# EasyEDA schematic SCH_Krishveer's-HackBoard_2025-03-21.json

## Sheets
1 Switches: TITLE: Sheet_1; REV: 1.0; Date: 2025-02-24; Sheet: 1/1; Drawn By: krishveersinghkhurana; Company: Your Company
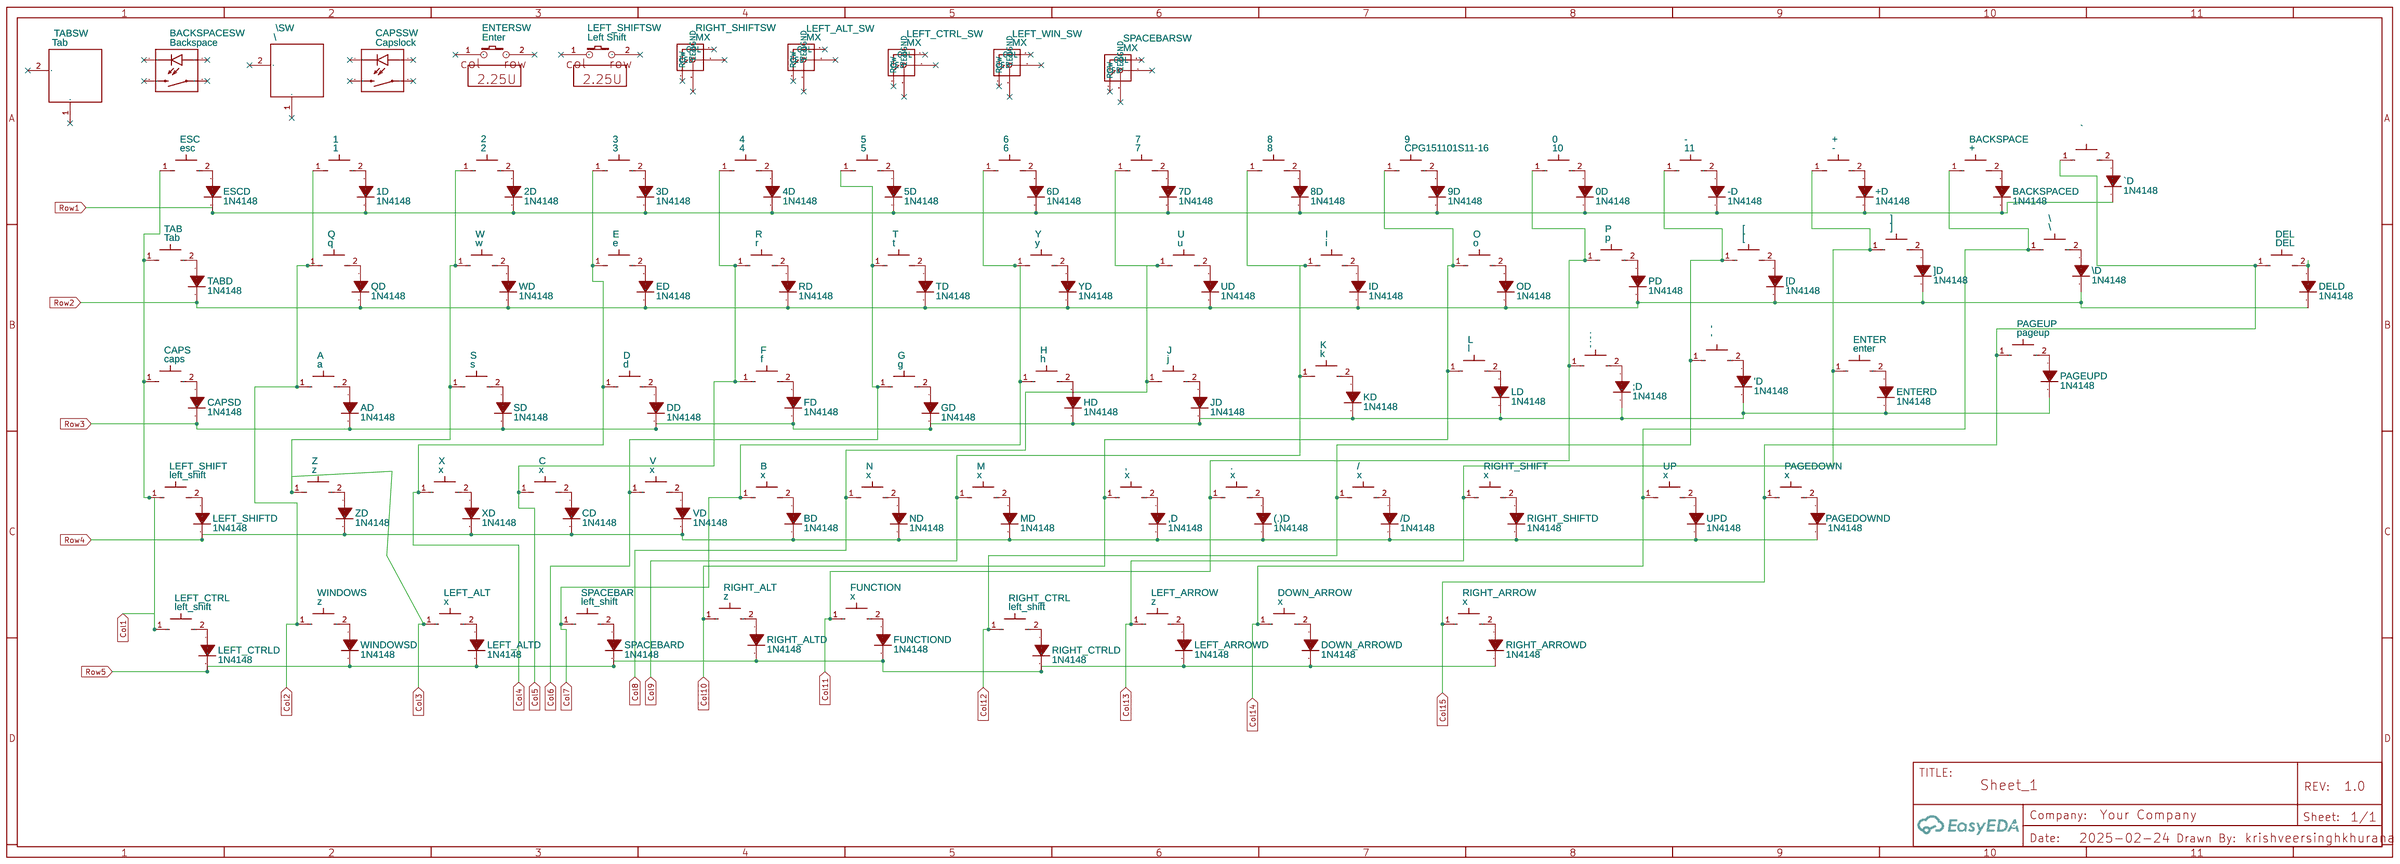
[diagram p0: Switches]
2 MCU: TITLE: Sheet_2
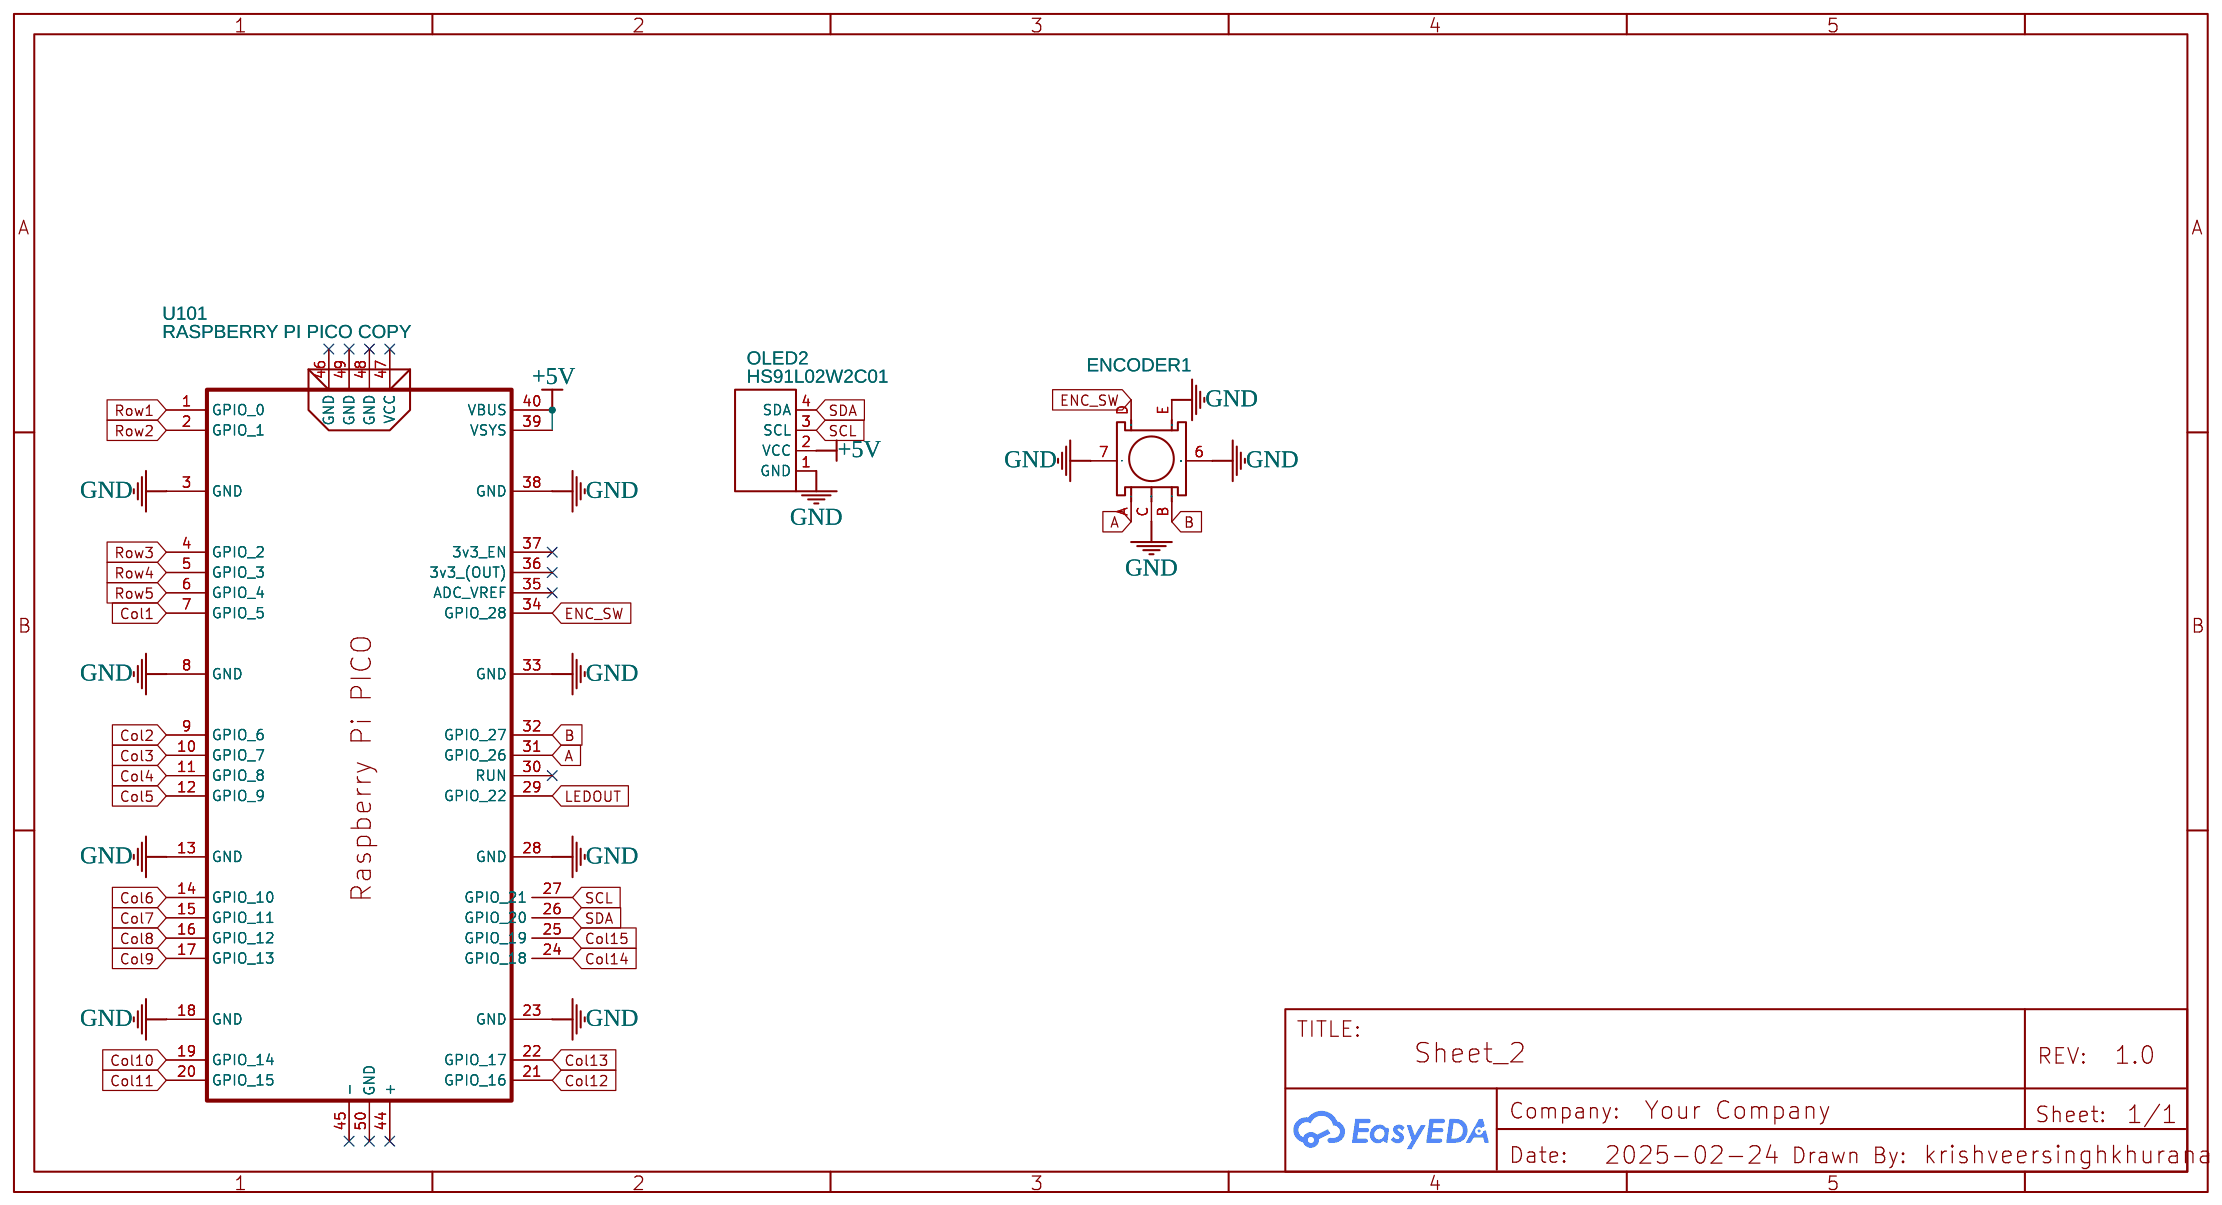
[diagram p1: MCU]
3 LED: Date: 2025-03-15
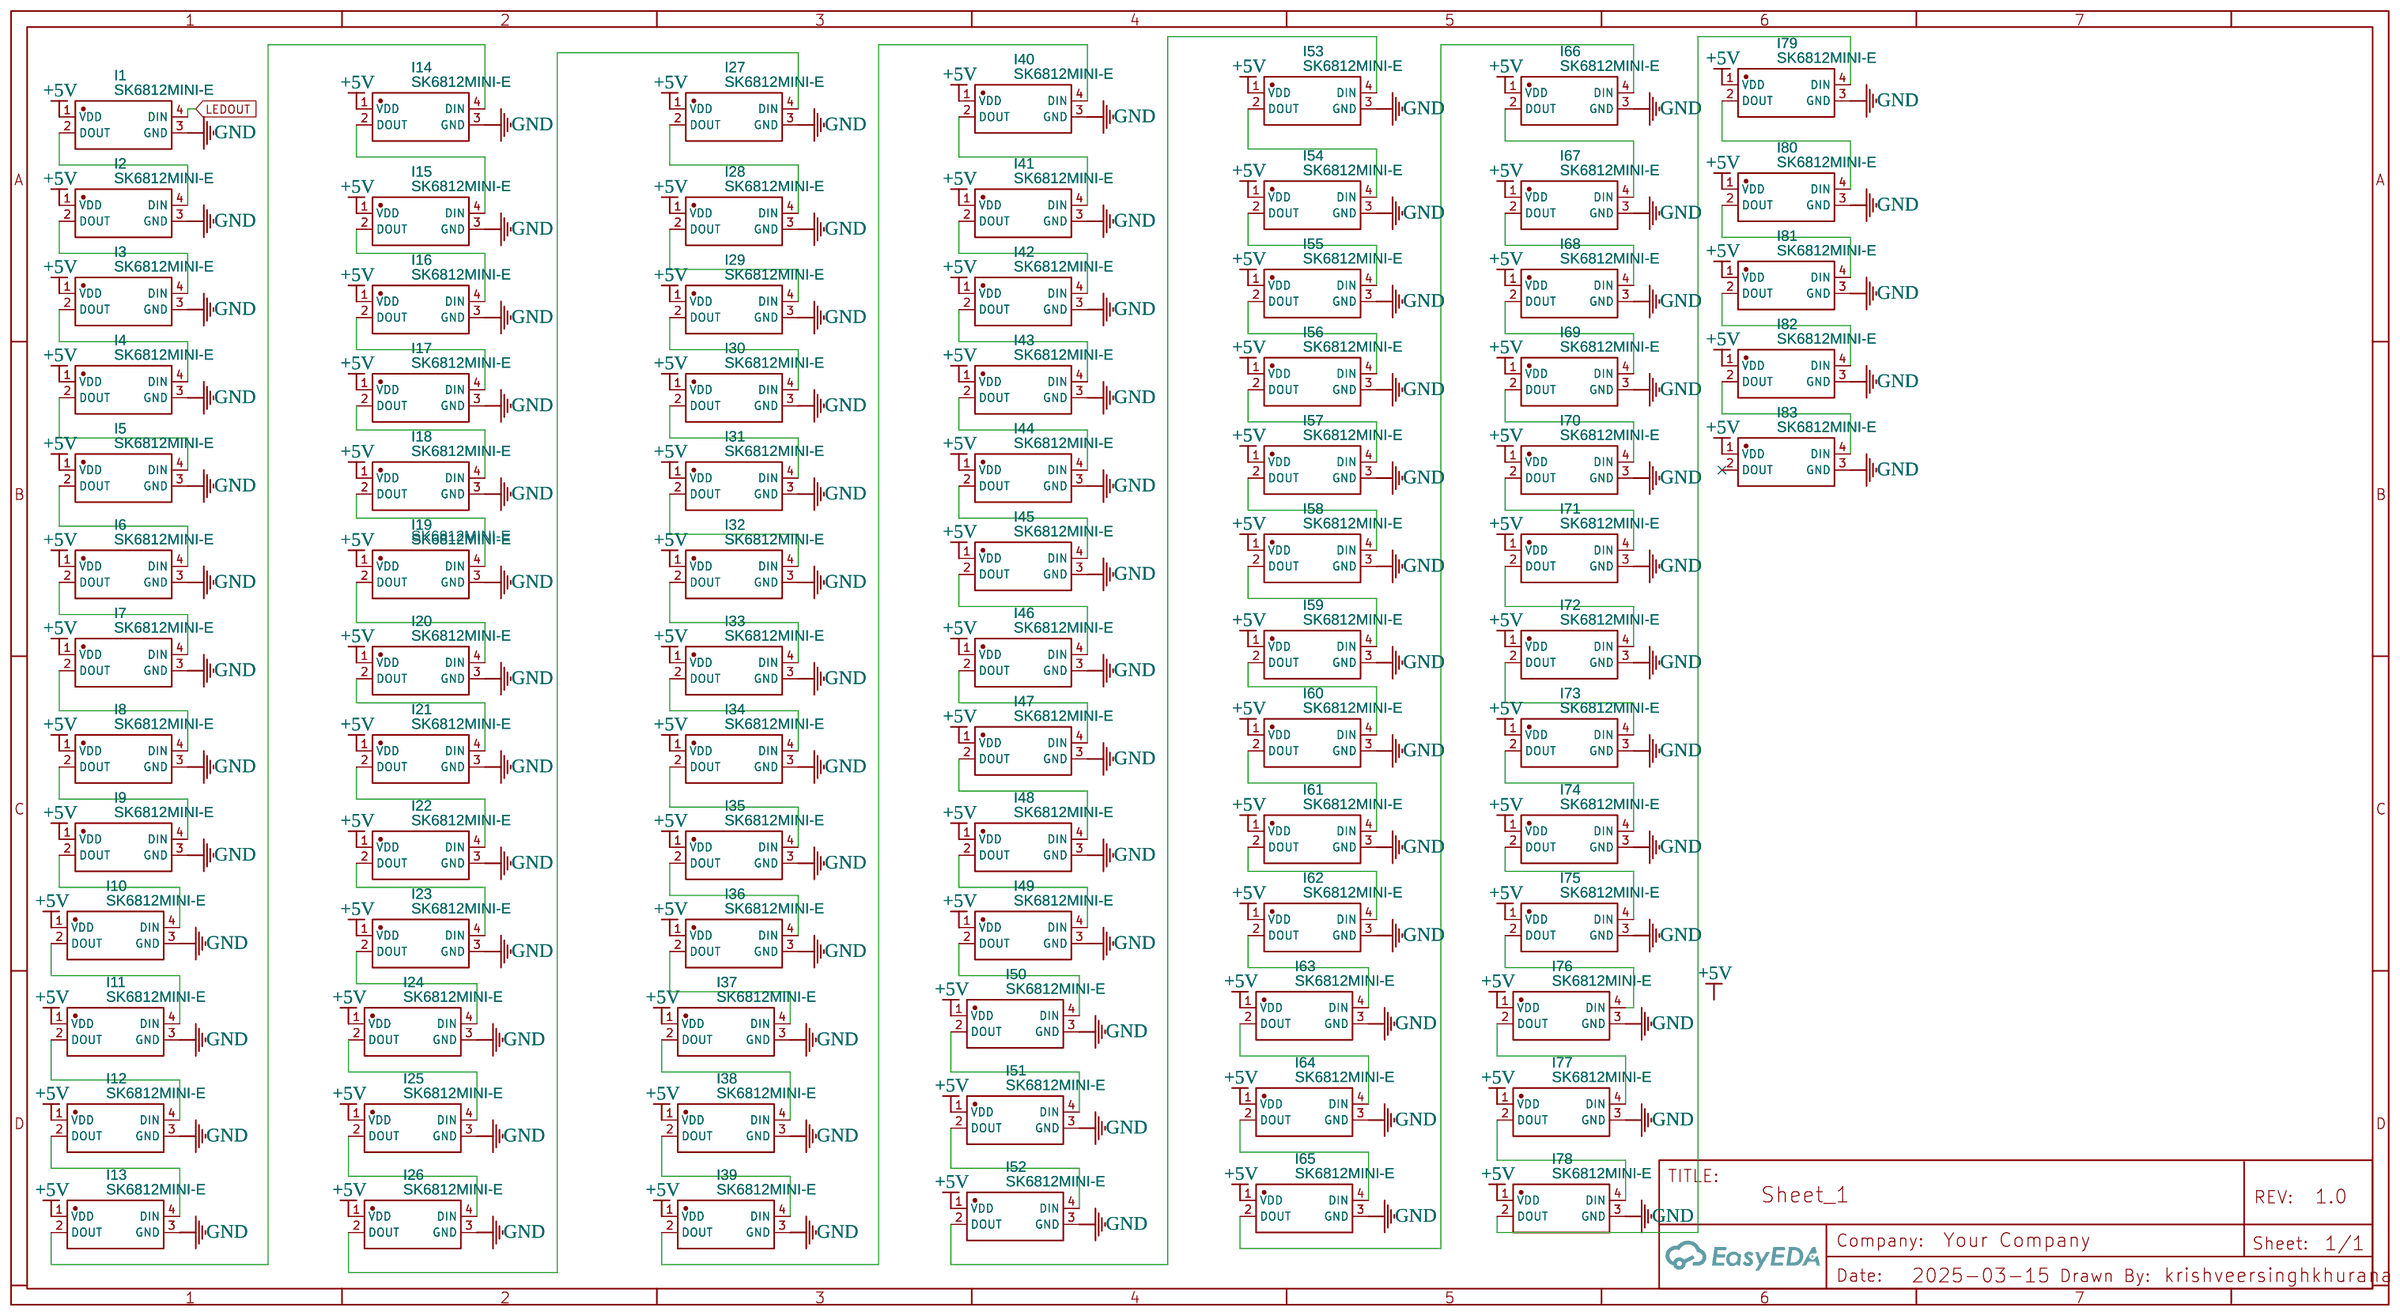
[diagram p2: LED]

## Parts
sheet LED
I1  SK6812MINI-E  [LED-SMD_L3.2-W2.8-P1.50-LS5.8-TR-EH]
I2  SK6812MINI-E  [LED-SMD_L3.2-W2.8-P1.50-LS5.8-TR-EH]
I3  SK6812MINI-E  [LED-SMD_L3.2-W2.8-P1.50-LS5.8-TR-EH]
I4  SK6812MINI-E  [LED-SMD_L3.2-W2.8-P1.50-LS5.8-TR-EH]
I5  SK6812MINI-E  [LED-SMD_L3.2-W2.8-P1.50-LS5.8-TR-EH]
I6  SK6812MINI-E  [LED-SMD_L3.2-W2.8-P1.50-LS5.8-TR-EH]
I7  SK6812MINI-E  [LED-SMD_L3.2-W2.8-P1.50-LS5.8-TR-EH]
I8  SK6812MINI-E  [LED-SMD_L3.2-W2.8-P1.50-LS5.8-TR-EH]
I9  SK6812MINI-E  [LED-SMD_L3.2-W2.8-P1.50-LS5.8-TR-EH]
I10  SK6812MINI-E  [LED-SMD_L3.2-W2.8-P1.50-LS5.8-TR-EH]
I11  SK6812MINI-E  [LED-SMD_L3.2-W2.8-P1.50-LS5.8-TR-EH]
I12  SK6812MINI-E  [LED-SMD_L3.2-W2.8-P1.50-LS5.8-TR-EH]
I13  SK6812MINI-E  [LED-SMD_L3.2-W2.8-P1.50-LS5.8-TR-EH]
I14  SK6812MINI-E  [LED-SMD_L3.2-W2.8-P1.50-LS5.8-TR-EH]
I15  SK6812MINI-E  [LED-SMD_L3.2-W2.8-P1.50-LS5.8-TR-EH]
I16  SK6812MINI-E  [LED-SMD_L3.2-W2.8-P1.50-LS5.8-TR-EH]
I17  SK6812MINI-E  [LED-SMD_L3.2-W2.8-P1.50-LS5.8-TR-EH]
I18  SK6812MINI-E  [LED-SMD_L3.2-W2.8-P1.50-LS5.8-TR-EH]
I19  SK6812MINI-E  [LED-SMD_L3.2-W2.8-P1.50-LS5.8-TR-EH]
I20  SK6812MINI-E  [LED-SMD_L3.2-W2.8-P1.50-LS5.8-TR-EH]
I21  SK6812MINI-E  [LED-SMD_L3.2-W2.8-P1.50-LS5.8-TR-EH]
I22  SK6812MINI-E  [LED-SMD_L3.2-W2.8-P1.50-LS5.8-TR-EH]
I23  SK6812MINI-E  [LED-SMD_L3.2-W2.8-P1.50-LS5.8-TR-EH]
I24  SK6812MINI-E  [LED-SMD_L3.2-W2.8-P1.50-LS5.8-TR-EH]
I25  SK6812MINI-E  [LED-SMD_L3.2-W2.8-P1.50-LS5.8-TR-EH]
I26  SK6812MINI-E  [LED-SMD_L3.2-W2.8-P1.50-LS5.8-TR-EH]
I27  SK6812MINI-E  [LED-SMD_L3.2-W2.8-P1.50-LS5.8-TR-EH]
I28  SK6812MINI-E  [LED-SMD_L3.2-W2.8-P1.50-LS5.8-TR-EH]
I29  SK6812MINI-E  [LED-SMD_L3.2-W2.8-P1.50-LS5.8-TR-EH]
I30  SK6812MINI-E  [LED-SMD_L3.2-W2.8-P1.50-LS5.8-TR-EH]
I31  SK6812MINI-E  [LED-SMD_L3.2-W2.8-P1.50-LS5.8-TR-EH]
I32  SK6812MINI-E  [LED-SMD_L3.2-W2.8-P1.50-LS5.8-TR-EH]
I33  SK6812MINI-E  [LED-SMD_L3.2-W2.8-P1.50-LS5.8-TR-EH]
I34  SK6812MINI-E  [LED-SMD_L3.2-W2.8-P1.50-LS5.8-TR-EH]
I35  SK6812MINI-E  [LED-SMD_L3.2-W2.8-P1.50-LS5.8-TR-EH]
I36  SK6812MINI-E  [LED-SMD_L3.2-W2.8-P1.50-LS5.8-TR-EH]
I37  SK6812MINI-E  [LED-SMD_L3.2-W2.8-P1.50-LS5.8-TR-EH]
I38  SK6812MINI-E  [LED-SMD_L3.2-W2.8-P1.50-LS5.8-TR-EH]
I39  SK6812MINI-E  [LED-SMD_L3.2-W2.8-P1.50-LS5.8-TR-EH]
I40  SK6812MINI-E  [LED-SMD_L3.2-W2.8-P1.50-LS5.8-TR-EH]
I41  SK6812MINI-E  [LED-SMD_L3.2-W2.8-P1.50-LS5.8-TR-EH]
I42  SK6812MINI-E  [LED-SMD_L3.2-W2.8-P1.50-LS5.8-TR-EH]
I43  SK6812MINI-E  [LED-SMD_L3.2-W2.8-P1.50-LS5.8-TR-EH]
I44  SK6812MINI-E  [LED-SMD_L3.2-W2.8-P1.50-LS5.8-TR-EH]
I45  SK6812MINI-E  [LED-SMD_L3.2-W2.8-P1.50-LS5.8-TR-EH]
I46  SK6812MINI-E  [LED-SMD_L3.2-W2.8-P1.50-LS5.8-TR-EH]
I47  SK6812MINI-E  [LED-SMD_L3.2-W2.8-P1.50-LS5.8-TR-EH]
I48  SK6812MINI-E  [LED-SMD_L3.2-W2.8-P1.50-LS5.8-TR-EH]
I49  SK6812MINI-E  [LED-SMD_L3.2-W2.8-P1.50-LS5.8-TR-EH]
I50  SK6812MINI-E  [LED-SMD_L3.2-W2.8-P1.50-LS5.8-TR-EH]
I51  SK6812MINI-E  [LED-SMD_L3.2-W2.8-P1.50-LS5.8-TR-EH]
I52  SK6812MINI-E  [LED-SMD_L3.2-W2.8-P1.50-LS5.8-TR-EH]
I53  SK6812MINI-E  [LED-SMD_L3.2-W2.8-P1.50-LS5.8-TR-EH]
I54  SK6812MINI-E  [LED-SMD_L3.2-W2.8-P1.50-LS5.8-TR-EH]
I55  SK6812MINI-E  [LED-SMD_L3.2-W2.8-P1.50-LS5.8-TR-EH]
I56  SK6812MINI-E  [LED-SMD_L3.2-W2.8-P1.50-LS5.8-TR-EH]
I57  SK6812MINI-E  [LED-SMD_L3.2-W2.8-P1.50-LS5.8-TR-EH]
I58  SK6812MINI-E  [LED-SMD_L3.2-W2.8-P1.50-LS5.8-TR-EH]
I59  SK6812MINI-E  [LED-SMD_L3.2-W2.8-P1.50-LS5.8-TR-EH]
I60  SK6812MINI-E  [LED-SMD_L3.2-W2.8-P1.50-LS5.8-TR-EH]
I61  SK6812MINI-E  [LED-SMD_L3.2-W2.8-P1.50-LS5.8-TR-EH]
I62  SK6812MINI-E  [LED-SMD_L3.2-W2.8-P1.50-LS5.8-TR-EH]
I63  SK6812MINI-E  [LED-SMD_L3.2-W2.8-P1.50-LS5.8-TR-EH]
I64  SK6812MINI-E  [LED-SMD_L3.2-W2.8-P1.50-LS5.8-TR-EH]
I65  SK6812MINI-E  [LED-SMD_L3.2-W2.8-P1.50-LS5.8-TR-EH]
I66  SK6812MINI-E  [LED-SMD_L3.2-W2.8-P1.50-LS5.8-TR-EH]
I67  SK6812MINI-E  [LED-SMD_L3.2-W2.8-P1.50-LS5.8-TR-EH]
I68  SK6812MINI-E  [LED-SMD_L3.2-W2.8-P1.50-LS5.8-TR-EH]
I69  SK6812MINI-E  [LED-SMD_L3.2-W2.8-P1.50-LS5.8-TR-EH]
I70  SK6812MINI-E  [LED-SMD_L3.2-W2.8-P1.50-LS5.8-TR-EH]
I71  SK6812MINI-E  [LED-SMD_L3.2-W2.8-P1.50-LS5.8-TR-EH]
I72  SK6812MINI-E  [LED-SMD_L3.2-W2.8-P1.50-LS5.8-TR-EH]
I73  SK6812MINI-E  [LED-SMD_L3.2-W2.8-P1.50-LS5.8-TR-EH]
I74  SK6812MINI-E  [LED-SMD_L3.2-W2.8-P1.50-LS5.8-TR-EH]
I75  SK6812MINI-E  [LED-SMD_L3.2-W2.8-P1.50-LS5.8-TR-EH]
I76  SK6812MINI-E  [LED-SMD_L3.2-W2.8-P1.50-LS5.8-TR-EH]
I77  SK6812MINI-E  [LED-SMD_L3.2-W2.8-P1.50-LS5.8-TR-EH]
I78  SK6812MINI-E  [LED-SMD_L3.2-W2.8-P1.50-LS5.8-TR-EH]
I79  SK6812MINI-E  [LED-SMD_L3.2-W2.8-P1.50-LS5.8-TR-EH]
I80  SK6812MINI-E  [LED-SMD_L3.2-W2.8-P1.50-LS5.8-TR-EH]
I81  SK6812MINI-E  [LED-SMD_L3.2-W2.8-P1.50-LS5.8-TR-EH]
I82  SK6812MINI-E  [LED-SMD_L3.2-W2.8-P1.50-LS5.8-TR-EH]
I83  SK6812MINI-E  [LED-SMD_L3.2-W2.8-P1.50-LS5.8-TR-EH]
sheet MCU
ENCODER1  EC11E09244AQ  [SW-TH_EC11XXXXXXXX]
OLED2  HS91L02W2C01  [OLED-TH_L38.0-W12.0_HS91L02W2C01]
U101  RASPBERRY PI PICO COPY  [RASPBERRY PI PICO/ RASPBERRY PI PICO W]
sheet Switches
0  10  [SMD_KEYBOARD-SW]
0D  1N4148  [DO-35_BD2.0-L4.0-P8.00-D0.5-FD]
1  1  [SMD_KEYBOARD-SW]
1D  1N4148  [DO-35_BD2.0-L4.0-P8.00-D0.5-FD]
2  2  [SMD_KEYBOARD-SW]
2D  1N4148  [DO-35_BD2.0-L4.0-P8.00-D0.5-FD]
3  3  [SMD_KEYBOARD-SW]
3D  1N4148  [DO-35_BD2.0-L4.0-P8.00-D0.5-FD]
4  4  [SMD_KEYBOARD-SW]
4D  1N4148  [DO-35_BD2.0-L4.0-P8.00-D0.5-FD]
5  5  [SMD_KEYBOARD-SW]
5D  1N4148  [DO-35_BD2.0-L4.0-P8.00-D0.5-FD]
6  6  [SMD_KEYBOARD-SW]
6D  1N4148  [DO-35_BD2.0-L4.0-P8.00-D0.5-FD]
7  7  [SMD_KEYBOARD-SW]
7D  1N4148  [DO-35_BD2.0-L4.0-P8.00-D0.5-FD]
8  8  [SMD_KEYBOARD-SW]
8D  1N4148  [DO-35_BD2.0-L4.0-P8.00-D0.5-FD]
9  CPG151101S11-16  [SMD_KEYBOARD-SW]
9D  1N4148  [DO-35_BD2.0-L4.0-P8.00-D0.5-FD]
&#96;  Backspace swap  [SMD_KEYBOARD-SW]
&#96;D  1N4148  [DO-35_BD2.0-L4.0-P8.00-D0.5-FD]
'  '  [SMD_KEYBOARD-SW]
'D  1N4148  [DO-35_BD2.0-L4.0-P8.00-D0.5-FD]
(.)D  1N4148  [DO-35_BD2.0-L4.0-P8.00-D0.5-FD]
+  -  [SMD_KEYBOARD-SW]
+D  1N4148  [DO-35_BD2.0-L4.0-P8.00-D0.5-FD]
,  x  [SMD_KEYBOARD-SW]
,D  1N4148  [DO-35_BD2.0-L4.0-P8.00-D0.5-FD]
-  11  [SMD_KEYBOARD-SW]
-D  1N4148  [DO-35_BD2.0-L4.0-P8.00-D0.5-FD]
.  x  [SMD_KEYBOARD-SW]
/  x  [SMD_KEYBOARD-SW]
/D  1N4148  [DO-35_BD2.0-L4.0-P8.00-D0.5-FD]
;  ;  [SMD_KEYBOARD-SW]
;D  1N4148  [DO-35_BD2.0-L4.0-P8.00-D0.5-FD]
[  [  [SMD_KEYBOARD-SW]
[D  1N4148  [DO-35_BD2.0-L4.0-P8.00-D0.5-FD]
\  \  [SMD_KEYBOARD-SW]
\D  1N4148  [DO-35_BD2.0-L4.0-P8.00-D0.5-FD]
\SW  \  [CHERRY-MX-PCB-1.5U]
]  ]  [SMD_KEYBOARD-SW]
]D  1N4148  [DO-35_BD2.0-L4.0-P8.00-D0.5-FD]
`  Backspace swap
`D  1N4148
A  a  [SMD_KEYBOARD-SW]
AD  1N4148  [DO-35_BD2.0-L4.0-P8.00-D0.5-FD]
B  x  [SMD_KEYBOARD-SW]
BACKSPACE  +  [SMD_KEYBOARD-SW]
BACKSPACED  1N4148  [DO-35_BD2.0-L4.0-P8.00-D0.5-FD]
BACKSPACESW  Backspace  [CHERRY-MX-LED-1X2U]
BD  1N4148  [DO-35_BD2.0-L4.0-P8.00-D0.5-FD]
C  x  [SMD_KEYBOARD-SW]
CAPS  caps  [SMD_KEYBOARD-SW]
CAPSD  1N4148  [DO-35_BD2.0-L4.0-P8.00-D0.5-FD]
CAPSSW  Capslock  [CHERRY-MX-LED-1.75U]
CD  1N4148  [DO-35_BD2.0-L4.0-P8.00-D0.5-FD]
D  d  [SMD_KEYBOARD-SW]
DD  1N4148  [DO-35_BD2.0-L4.0-P8.00-D0.5-FD]
DEL  DEL  [SMD_KEYBOARD-SW]
DELD  1N4148  [DO-35_BD2.0-L4.0-P8.00-D0.5-FD]
DOWN_ARROW  x  [SMD_KEYBOARD-SW]
DOWN_ARROWD  1N4148  [DO-35_BD2.0-L4.0-P8.00-D0.5-FD]
E  e  [SMD_KEYBOARD-SW]
ED  1N4148  [DO-35_BD2.0-L4.0-P8.00-D0.5-FD]
ENTER  enter  [SMD_KEYBOARD-SW]
ENTERD  1N4148  [DO-35_BD2.0-L4.0-P8.00-D0.5-FD]
ENTERSW  Enter  [CHERRY-MX-PCB-2.25U-SILK]
ESC  esc  [SMD_KEYBOARD-SW]
ESCD  1N4148  [DO-35_BD2.0-L4.0-P8.00-D0.5-FD]
F  f  [SMD_KEYBOARD-SW]
FD  1N4148  [DO-35_BD2.0-L4.0-P8.00-D0.5-FD]
FUNCTION  x  [SMD_KEYBOARD-SW]
FUNCTIOND  1N4148  [DO-35_BD2.0-L4.0-P8.00-D0.5-FD]
G  g  [SMD_KEYBOARD-SW]
GD  1N4148  [DO-35_BD2.0-L4.0-P8.00-D0.5-FD]
H  h  [SMD_KEYBOARD-SW]
HD  1N4148  [DO-35_BD2.0-L4.0-P8.00-D0.5-FD]
I  i  [SMD_KEYBOARD-SW]
ID  1N4148  [DO-35_BD2.0-L4.0-P8.00-D0.5-FD]
J  j  [SMD_KEYBOARD-SW]
JD  1N4148  [DO-35_BD2.0-L4.0-P8.00-D0.5-FD]
K  k  [SMD_KEYBOARD-SW]
KD  1N4148  [DO-35_BD2.0-L4.0-P8.00-D0.5-FD]
L  l  [SMD_KEYBOARD-SW]
LD  1N4148  [DO-35_BD2.0-L4.0-P8.00-D0.5-FD]
LEFT_ALT  x  [SMD_KEYBOARD-SW]
LEFT_ALT_SW  MX  [CHERRY MX 1.25U]
LEFT_ALTD  1N4148  [DO-35_BD2.0-L4.0-P8.00-D0.5-FD]
LEFT_ARROW  z  [SMD_KEYBOARD-SW]
LEFT_ARROWD  1N4148  [DO-35_BD2.0-L4.0-P8.00-D0.5-FD]
LEFT_CTRL  left_shift  [SMD_KEYBOARD-SW]
LEFT_CTRL_SW  MX  [CHERRY MX 1.25U]
LEFT_CTRLD  1N4148  [DO-35_BD2.0-L4.0-P8.00-D0.5-FD]
LEFT_SHIFT  left_shift  [SMD_KEYBOARD-SW]
LEFT_SHIFTD  1N4148  [DO-35_BD2.0-L4.0-P8.00-D0.5-FD]
LEFT_SHIFTSW  Left Shift  [CHERRY-MX-PCB-2.25U-SILK]
LEFT_WIN_SW  MX  [CHERRY MX 1.25U]
M  x  [SMD_KEYBOARD-SW]
MD  1N4148  [DO-35_BD2.0-L4.0-P8.00-D0.5-FD]
N  x  [SMD_KEYBOARD-SW]
ND  1N4148  [DO-35_BD2.0-L4.0-P8.00-D0.5-FD]
O  o  [SMD_KEYBOARD-SW]
OD  1N4148  [DO-35_BD2.0-L4.0-P8.00-D0.5-FD]
P  p  [SMD_KEYBOARD-SW]
PAGEDOWN  x  [SMD_KEYBOARD-SW]
PAGEDOWND  1N4148  [DO-35_BD2.0-L4.0-P8.00-D0.5-FD]
PAGEUP  pageup  [SMD_KEYBOARD-SW]
PAGEUPD  1N4148  [DO-35_BD2.0-L4.0-P8.00-D0.5-FD]
PD  1N4148  [DO-35_BD2.0-L4.0-P8.00-D0.5-FD]
Q  q  [SMD_KEYBOARD-SW]
QD  1N4148  [DO-35_BD2.0-L4.0-P8.00-D0.5-FD]
R  r  [SMD_KEYBOARD-SW]
RD  1N4148  [DO-35_BD2.0-L4.0-P8.00-D0.5-FD]
RIGHT_ALT  z  [SMD_KEYBOARD-SW]
RIGHT_ALTD  1N4148  [DO-35_BD2.0-L4.0-P8.00-D0.5-FD]
RIGHT_ARROW  x  [SMD_KEYBOARD-SW]
RIGHT_ARROWD  1N4148  [DO-35_BD2.0-L4.0-P8.00-D0.5-FD]
RIGHT_CTRL  left_shift  [SMD_KEYBOARD-SW]
RIGHT_CTRLD  1N4148  [DO-35_BD2.0-L4.0-P8.00-D0.5-FD]
RIGHT_SHIFT  x  [SMD_KEYBOARD-SW]
RIGHT_SHIFTD  1N4148  [DO-35_BD2.0-L4.0-P8.00-D0.5-FD]
RIGHT_SHIFTSW  MX  [CHERRY MX 1.75U]
S  s  [SMD_KEYBOARD-SW]
SD  1N4148  [DO-35_BD2.0-L4.0-P8.00-D0.5-FD]
SPACEBAR  left_shift  [SMD_KEYBOARD-SW]
SPACEBARD  1N4148  [DO-35_BD2.0-L4.0-P8.00-D0.5-FD]
SPACEBARSW  MX  [CHERRY MX 6.25U]
T  t  [SMD_KEYBOARD-SW]
TAB  Tab  [SMD_KEYBOARD-SW]
TABD  1N4148  [DO-35_BD2.0-L4.0-P8.00-D0.5-FD]
TABSW  Tab  [CHERRY-MX-PCB-1.5U]
TD  1N4148  [DO-35_BD2.0-L4.0-P8.00-D0.5-FD]
U  u  [SMD_KEYBOARD-SW]
UD  1N4148  [DO-35_BD2.0-L4.0-P8.00-D0.5-FD]
UP  x  [SMD_KEYBOARD-SW]
UPD  1N4148  [DO-35_BD2.0-L4.0-P8.00-D0.5-FD]
V  x  [SMD_KEYBOARD-SW]
VD  1N4148  [DO-35_BD2.0-L4.0-P8.00-D0.5-FD]
W  w  [SMD_KEYBOARD-SW]
WD  1N4148  [DO-35_BD2.0-L4.0-P8.00-D0.5-FD]
WINDOWS  z  [SMD_KEYBOARD-SW]
WINDOWSD  1N4148  [DO-35_BD2.0-L4.0-P8.00-D0.5-FD]
X  x  [SMD_KEYBOARD-SW]
XD  1N4148  [DO-35_BD2.0-L4.0-P8.00-D0.5-FD]
Y  y  [SMD_KEYBOARD-SW]
YD  1N4148  [DO-35_BD2.0-L4.0-P8.00-D0.5-FD]
Z  z  [SMD_KEYBOARD-SW]
ZD  1N4148  [DO-35_BD2.0-L4.0-P8.00-D0.5-FD]

## Library data of the parts
I1-I83 = SK6812MINI-E: Contributor: LCSC; Supplier: LCSC; Supplier Part: C9900001298; Manufacturer: null; JLCPCB Part Class: Extended Part
ENCODER1 = EC11E09244AQ: Contributor: LCSC; Supplier: LCSC; Supplier Part: C470753; Manufacturer: ALPSALPINE(阿尔卑斯阿尔派); JLCPCB Part Class: Extended Part
OLED2 = HS91L02W2C01: Supplier: LCSC; Supplier Part: C5248081; Manufacturer: HS(汉昇); JLCPCB Part Class: Extended Part; Contributor: lcsc
U101 = RASPBERRY PI PICO COPY: Contributor: grawik
0-9 &#96; ' + , - . / ; [ \ ] A B BACKSPACE C CAPS D DEL DOWN_ARROW E ENTER ESC F FUNCTION G H I J K L LEFT_ALT LEFT_ARROW LEFT_CTRL LEFT_SHIFT M N O P PAGEDOWN PAGEUP Q R RIGHT_ALT RIGHT_ARROW RIGHT_CTRL RIGHT_SHIFT S SPACEBAR T TAB U UP V W WINDOWS X Y Z = CPG151101S11-16: Contributor: lcsc; Supplier: LCSC; Supplier Part: C5156480; Manufacturer: Kailh(凯华); JLCPCB Part Class: Extended Part
0D 1D 2D 3D 4D 5D 6D 7D 8D 9D &#96;D 'D (.)D +D ,D -D /D ;D [D \D ]D AD BACKSPACED BD CAPSD CD DD DELD DOWN_ARROWD ED ENTERD ESCD FD FUNCTIOND GD HD ID JD KD LD LEFT_ALTD LEFT_ARROWD LEFT_CTRLD LEFT_SHIFTD MD ND OD PAGEDOWND PAGEUPD PD QD RD RIGHT_ALTD RIGHT_ARROWD RIGHT_CTRLD RIGHT_SHIFTD SD SPACEBARD TABD TD UD UPD VD WD WINDOWSD XD YD ZD = 1N4148: Supplier: LCSC; Manufacturer: ST(先科); Supplier Part: C14516; JLCPCB Part Class: Extended Part
\SW TABSW = CHERRY-1.5U: Manufacturer Part: CHERRY; Contributor: cmh1217
` = CPG151101S11-16_14: Manufacturer Part: CPG151101S11-16; Manufacturer: Kailh(凯华); Supplier Part: C5156480; Supplier: LCSC
`D = 1N4148_39: Manufacturer: ST(先科); Supplier Part: C14516; Supplier: LCSC
BACKSPACESW = MECHANICAL-KEYBOARD2U: Contributor: Евгений Карло
CAPSSW = MECHANICAL-KEYBOARD1.75U: Contributor: Von Steuben
ENTERSW LEFT_SHIFTSW = CHERRY-MX-SW-2.25U: Supplier: CHERRY; Manufacturer Part: MX-SWITCH?; Contributor: Vuth
LEFT_ALT_SW LEFT_CTRL_SW LEFT_WIN_SW RIGHT_SHIFTSW SPACEBARSW = MX: Contributor: ai03

## Nets
+5V: I1.1(VDD) I2.1(VDD) I3.1(VDD) I4.1(VDD) I5.1(VDD) I6.1(VDD) I7.1(VDD) I8.1(VDD) I9.1(VDD) I10.1(VDD) I11.1(VDD) I12.1(VDD) I13.1(VDD) I14.1(VDD) I15.1(VDD) I16.1(VDD) I17.1(VDD) I18.1(VDD) I19.1(VDD) I20.1(VDD) I21.1(VDD) I22.1(VDD) I23.1(VDD) I24.1(VDD) I25.1(VDD) I26.1(VDD) I27.1(VDD) I28.1(VDD) I29.1(VDD) I30.1(VDD) I31.1(VDD) I32.1(VDD) I33.1(VDD) I34.1(VDD) I35.1(VDD) I36.1(VDD) I37.1(VDD) I38.1(VDD) I39.1(VDD) I40.1(VDD) I41.1(VDD) I42.1(VDD) I43.1(VDD) I44.1(VDD) I45.1(VDD) I46.1(VDD) I47.1(VDD) I48.1(VDD) I49.1(VDD) I50.1(VDD) I51.1(VDD) I52.1(VDD) I53.1(VDD) I54.1(VDD) I55.1(VDD) I56.1(VDD) I57.1(VDD) I58.1(VDD) I59.1(VDD) I60.1(VDD) I61.1(VDD) I62.1(VDD) I63.1(VDD) I64.1(VDD) I65.1(VDD) I66.1(VDD) I67.1(VDD) I68.1(VDD) I69.1(VDD) I70.1(VDD) I71.1(VDD) I72.1(VDD) I73.1(VDD) I74.1(VDD) I75.1(VDD) I76.1(VDD) I77.1(VDD) I78.1(VDD) I79.1(VDD) I80.1(VDD) I81.1(VDD) I82.1(VDD) I83.1(VDD) OLED2.2(VCC) U101.39(VSYS) U101.40(VBUS)
GND: ENCODER1.6 ENCODER1.7 ENCODER1.C ENCODER1.E I1.3(GND) I2.3(GND) I3.3(GND) I4.3(GND) I5.3(GND) I6.3(GND) I7.3(GND) I8.3(GND) I9.3(GND) I10.3(GND) I11.3(GND) I12.3(GND) I13.3(GND) I14.3(GND) I15.3(GND) I16.3(GND) I17.3(GND) I18.3(GND) I19.3(GND) I20.3(GND) I21.3(GND) I22.3(GND) I23.3(GND) I24.3(GND) I25.3(GND) I26.3(GND) I27.3(GND) I28.3(GND) I29.3(GND) I30.3(GND) I31.3(GND) I32.3(GND) I33.3(GND) I34.3(GND) I35.3(GND) I36.3(GND) I37.3(GND) I38.3(GND) I39.3(GND) I40.3(GND) I41.3(GND) I42.3(GND) I43.3(GND) I44.3(GND) I45.3(GND) I46.3(GND) I47.3(GND) I48.3(GND) I49.3(GND) I50.3(GND) I51.3(GND) I52.3(GND) I53.3(GND) I54.3(GND) I55.3(GND) I56.3(GND) I57.3(GND) I58.3(GND) I59.3(GND) I60.3(GND) I61.3(GND) I62.3(GND) I63.3(GND) I64.3(GND) I65.3(GND) I66.3(GND) I67.3(GND) I68.3(GND) I69.3(GND) I70.3(GND) I71.3(GND) I72.3(GND) I73.3(GND) I74.3(GND) I75.3(GND) I76.3(GND) I77.3(GND) I78.3(GND) I79.3(GND) I80.3(GND) I81.3(GND) I82.3(GND) I83.3(GND) OLED2.1(GND) U101.3(GND) U101.8(GND) U101.13(GND) U101.18(GND) U101.23(GND) U101.28(GND) U101.33(GND) U101.38(GND)
A: ENCODER1.A U101.31(GPIO 26)
B: ENCODER1.B U101.32(GPIO 27)
Col1: CAPS.1 ESC.1 LEFT_CTRL.1 LEFT_SHIFT.1 TAB.1 U101.7(GPIO 5)
Col2: 1.1 A.1 Q.1 U101.9(GPIO 6) WINDOWS.1
Col3: 2.1 LEFT_ALT.1 S.1 U101.10(GPIO 7) W.1 Z.1
Col4: 3.1 D.1 E.1 U101.11(GPIO 8) X.1
Col5: 4.1 C.1 F.1 R.1 U101.12(GPIO 9)
Col6: 5.1 G.1 T.1 U101.14(GPIO 10) V.1
Col7: 6.1 B.1 H.1 SPACEBAR.1 U101.15(GPIO 11) Y.1
Col8: 7.1 J.1 N.1 U.1 U101.16(GPIO 12)
Col9: 8.1 I.1 K.1 M.1 U101.17(GPIO 13)
Col10: 9.1 ,.1 L.1 O.1 RIGHT_ALT.1 U101.19(GPIO 14)
Col11: 0.1 ..1 ;.1 FUNCTION.1 P.1 U101.20(GPIO 15)
Col12: '.1 -.1 /.1 [.1 RIGHT_CTRL.1 U101.21(GPIO 16)
Col13: +.1 ].1 ENTER.1 LEFT_ARROW.1 RIGHT_SHIFT.1 U101.22(GPIO 17)
Col14: \.1 BACKSPACE.1 DOWN_ARROW.1 U101.24(GPIO 18) UP.1
Col15: &#96;.1 DEL.1 PAGEDOWN.1 PAGEUP.1 RIGHT_ARROW.1 U101.25(GPIO 19)
ENC_SW: ENCODER1.D U101.34(GPIO 28)
LEDOUT: I1.4(DIN) U101.29(GPIO 22)
Row1: 0D.2(C) 1D.2(C) 2D.2(C) 3D.2(C) 4D.2(C) 5D.2(C) 6D.2(C) 7D.2(C) 8D.2(C) 9D.2(C) &#96;D.2(C) +D.2(C) -D.2(C) BACKSPACED.2(C) ESCD.2(C) U101.1(GPIO 0)
Row2: [D.2(C) \D.2(C) ]D.2(C) DELD.2(C) ED.2(C) ID.2(C) OD.2(C) PD.2(C) QD.2(C) RD.2(C) TABD.2(C) TD.2(C) U101.2(GPIO 1) UD.2(C) WD.2(C) YD.2(C)
Row3: 'D.2(C) ;D.2(C) AD.2(C) CAPSD.2(C) DD.2(C) ENTERD.2(C) FD.2(C) GD.2(C) HD.2(C) JD.2(C) KD.2(C) LD.2(C) PAGEUPD.2(C) SD.2(C) U101.4(GPIO 2)
Row4: (.)D.2(C) ,D.2(C) /D.2(C) BD.2(C) CD.2(C) LEFT_SHIFTD.2(C) MD.2(C) ND.2(C) PAGEDOWND.2(C) RIGHT_SHIFTD.2(C) U101.5(GPIO 3) UPD.2(C) VD.2(C) XD.2(C) ZD.2(C)
Row5: DOWN_ARROWD.2(C) FUNCTIOND.2(C) LEFT_ALTD.2(C) LEFT_ARROWD.2(C) LEFT_CTRLD.2(C) RIGHT_ALTD.2(C) RIGHT_ARROWD.2(C) RIGHT_CTRLD.2(C) SPACEBARD.2(C) U101.6(GPIO 4) WINDOWSD.2(C)
SCL: OLED2.3(SCL) U101.27(GPIO 21)
SDA: OLED2.4(SDA) U101.26(GPIO 20)
Net-(0-2): 0.2 0D.1(A)
Net-(1-2): 1.2 1D.1(A)
Net-(2-2): 2.2 2D.1(A)
Net-(3-2): 3.2 3D.1(A)
Net-(4-2): 4.2 4D.1(A)
Net-(5-2): 5.2 5D.1(A)
Net-(6-2): 6.2 6D.1(A)
Net-(7-2): 7.2 7D.1(A)
Net-(8-2): 8.2 8D.1(A)
Net-(9-2): 9.2 9D.1(A)
Net-(&#96;-2): &#96;.2 &#96;D.1(A)
Net-('-2): '.2 'D.1(A)
Net-((.)D-1): (.)D.1(A) ..2
Net-(+-2): +.2 +D.1(A)
Net-(,-2): ,.2 ,D.1(A)
Net-(--2): -.2 -D.1(A)
Net-(/-2): /.2 /D.1(A)
Net-(;-2): ;.2 ;D.1(A)
Net-([-2): [.2 [D.1(A)
Net-(\-2): \.2 \D.1(A)
Net-(]-2): ].2 ]D.1(A)
Net-(A-2): A.2 AD.1(A)
Net-(B-2): B.2 BD.1(A)
Net-(BACKSPACE-2): BACKSPACE.2 BACKSPACED.1(A)
Net-(C-2): C.2 CD.1(A)
Net-(CAPS-2): CAPS.2 CAPSD.1(A)
Net-(D-2): D.2 DD.1(A)
Net-(DEL-2): DEL.2 DELD.1(A)
Net-(DOWN_ARROW-2): DOWN_ARROW.2 DOWN_ARROWD.1(A)
Net-(E-2): E.2 ED.1(A)
Net-(ENTER-2): ENTER.2 ENTERD.1(A)
Net-(ESC-2): ESC.2 ESCD.1(A)
Net-(F-2): F.2 FD.1(A)
Net-(FUNCTION-2): FUNCTION.2 FUNCTIOND.1(A)
Net-(G-2): G.2 GD.1(A)
Net-(H-2): H.2 HD.1(A)
Net-(I1-2): I1.2(DOUT) I2.4(DIN)
Net-(I2-2): I2.2(DOUT) I3.4(DIN)
Net-(I3-2): I3.2(DOUT) I4.4(DIN)
Net-(I4-2): I4.2(DOUT) I5.4(DIN)
Net-(I5-2): I5.2(DOUT) I6.4(DIN)
Net-(I6-2): I6.2(DOUT) I7.4(DIN)
Net-(I7-2): I7.2(DOUT) I8.4(DIN)
Net-(I8-2): I8.2(DOUT) I9.4(DIN)
Net-(I9-2): I9.2(DOUT) I10.4(DIN)
Net-(I10-2): I10.2(DOUT) I11.4(DIN)
Net-(I11-2): I11.2(DOUT) I12.4(DIN)
Net-(I12-2): I12.2(DOUT) I13.4(DIN)
Net-(I13-2): I13.2(DOUT) I14.4(DIN)
Net-(I14-2): I14.2(DOUT) I15.4(DIN)
Net-(I15-2): I15.2(DOUT) I16.4(DIN)
Net-(I16-2): I16.2(DOUT) I17.4(DIN)
Net-(I17-2): I17.2(DOUT) I18.4(DIN)
Net-(I18-2): I18.2(DOUT) I19.4(DIN)
Net-(I19-2): I19.2(DOUT) I20.4(DIN)
Net-(I20-2): I20.2(DOUT) I21.4(DIN)
Net-(I21-2): I21.2(DOUT) I22.4(DIN)
Net-(I22-2): I22.2(DOUT) I23.4(DIN)
Net-(I23-2): I23.2(DOUT) I24.4(DIN)
Net-(I24-2): I24.2(DOUT) I25.4(DIN)
Net-(I25-2): I25.2(DOUT) I26.4(DIN)
Net-(I26-2): I26.2(DOUT) I27.4(DIN)
Net-(I27-2): I27.2(DOUT) I28.4(DIN)
Net-(I28-2): I28.2(DOUT) I29.4(DIN)
Net-(I29-2): I29.2(DOUT) I30.4(DIN)
Net-(I30-2): I30.2(DOUT) I31.4(DIN)
Net-(I31-2): I31.2(DOUT) I32.4(DIN)
Net-(I32-2): I32.2(DOUT) I33.4(DIN)
Net-(I33-2): I33.2(DOUT) I34.4(DIN)
Net-(I34-2): I34.2(DOUT) I35.4(DIN)
Net-(I35-2): I35.2(DOUT) I36.4(DIN)
Net-(I36-2): I36.2(DOUT) I37.4(DIN)
Net-(I37-2): I37.2(DOUT) I38.4(DIN)
Net-(I38-2): I38.2(DOUT) I39.4(DIN)
Net-(I39-2): I39.2(DOUT) I40.4(DIN)
Net-(I40-2): I40.2(DOUT) I41.4(DIN)
Net-(I41-2): I41.2(DOUT) I42.4(DIN)
Net-(I42-2): I42.2(DOUT) I43.4(DIN)
Net-(I43-2): I43.2(DOUT) I44.4(DIN)
Net-(I44-2): I44.2(DOUT) I45.4(DIN)
Net-(I45-2): I45.2(DOUT) I46.4(DIN)
Net-(I46-2): I46.2(DOUT) I47.4(DIN)
Net-(I47-2): I47.2(DOUT) I48.4(DIN)
Net-(I48-2): I48.2(DOUT) I49.4(DIN)
Net-(I49-2): I49.2(DOUT) I50.4(DIN)
Net-(I50-2): I50.2(DOUT) I51.4(DIN)
Net-(I51-2): I51.2(DOUT) I52.4(DIN)
Net-(I52-2): I52.2(DOUT) I53.4(DIN)
Net-(I53-2): I53.2(DOUT) I54.4(DIN)
Net-(I54-2): I54.2(DOUT) I55.4(DIN)
Net-(I55-2): I55.2(DOUT) I56.4(DIN)
Net-(I56-2): I56.2(DOUT) I57.4(DIN)
Net-(I57-2): I57.2(DOUT) I58.4(DIN)
Net-(I58-2): I58.2(DOUT) I59.4(DIN)
Net-(I59-2): I59.2(DOUT) I60.4(DIN)
Net-(I60-2): I60.2(DOUT) I61.4(DIN)
Net-(I61-2): I61.2(DOUT) I62.4(DIN)
Net-(I62-2): I62.2(DOUT) I63.4(DIN)
Net-(I63-2): I63.2(DOUT) I64.4(DIN)
Net-(I64-2): I64.2(DOUT) I65.4(DIN)
Net-(I65-2): I65.2(DOUT) I66.4(DIN)
Net-(I66-2): I66.2(DOUT) I67.4(DIN)
Net-(I67-2): I67.2(DOUT) I68.4(DIN)
Net-(I68-2): I68.2(DOUT) I69.4(DIN)
Net-(I69-2): I69.2(DOUT) I70.4(DIN)
Net-(I70-2): I70.2(DOUT) I71.4(DIN)
Net-(I71-2): I71.2(DOUT) I72.4(DIN)
Net-(I72-2): I72.2(DOUT) I73.4(DIN)
Net-(I73-2): I73.2(DOUT) I74.4(DIN)
Net-(I74-2): I74.2(DOUT) I75.4(DIN)
Net-(I75-2): I75.2(DOUT) I76.4(DIN)
Net-(I76-2): I76.2(DOUT) I77.4(DIN)
Net-(I77-2): I77.2(DOUT) I78.4(DIN)
Net-(I78-2): I78.2(DOUT) I79.4(DIN)
Net-(I79-2): I79.2(DOUT) I80.4(DIN)
Net-(I80-2): I80.2(DOUT) I81.4(DIN)
Net-(I81-2): I81.2(DOUT) I82.4(DIN)
Net-(I82-2): I82.2(DOUT) I83.4(DIN)
Net-(I-2): I.2 ID.1(A)
Net-(J-2): J.2 JD.1(A)
Net-(K-2): K.2 KD.1(A)
Net-(L-2): L.2 LD.1(A)
Net-(LEFT_ALT-2): LEFT_ALT.2 LEFT_ALTD.1(A)
Net-(LEFT_ARROW-2): LEFT_ARROW.2 LEFT_ARROWD.1(A)
Net-(LEFT_CTRL-2): LEFT_CTRL.2 LEFT_CTRLD.1(A)
Net-(LEFT_SHIFT-2): LEFT_SHIFT.2 LEFT_SHIFTD.1(A)
Net-(M-2): M.2 MD.1(A)
Net-(N-2): N.2 ND.1(A)
Net-(O-2): O.2 OD.1(A)
Net-(P-2): P.2 PD.1(A)
Net-(PAGEDOWN-2): PAGEDOWN.2 PAGEDOWND.1(A)
Net-(PAGEUP-2): PAGEUP.2 PAGEUPD.1(A)
Net-(Q-2): Q.2 QD.1(A)
Net-(R-2): R.2 RD.1(A)
Net-(RIGHT_ALT-2): RIGHT_ALT.2 RIGHT_ALTD.1(A)
Net-(RIGHT_ARROW-2): RIGHT_ARROW.2 RIGHT_ARROWD.1(A)
Net-(RIGHT_CTRL-2): RIGHT_CTRL.2 RIGHT_CTRLD.1(A)
Net-(RIGHT_SHIFT-2): RIGHT_SHIFT.2 RIGHT_SHIFTD.1(A)
Net-(S-2): S.2 SD.1(A)
Net-(SPACEBAR-2): SPACEBAR.2 SPACEBARD.1(A)
Net-(T-2): T.2 TD.1(A)
Net-(TAB-2): TAB.2 TABD.1(A)
Net-(U-2): U.2 UD.1(A)
Net-(UP-2): UP.2 UPD.1(A)
Net-(V-2): V.2 VD.1(A)
Net-(W-2): W.2 WD.1(A)
Net-(WINDOWS-2): WINDOWS.2 WINDOWSD.1(A)
Net-(X-2): X.2 XD.1(A)
Net-(Y-2): Y.2 YD.1(A)
Net-(Z-2): Z.2 ZD.1(A)

Not connected (* = marked no-connect by the designer): \SW 1* 2*; BACKSPACESW A* K(C)* S1(1)* S2(2)*; CAPSSW A* K(C)* S1(1)* S2(2)*; ENTERSW 1(col)* 2(row)*; I83 2(DOUT)*; LEFT_ALT_SW COL* LED* LEDGND* ROW*; LEFT_CTRL_SW COL* LED* LEDGND* ROW*; LEFT_SHIFTSW 1(col)* 2(row)*; LEFT_WIN_SW COL* LED* LEDGND* ROW*; RIGHT_SHIFTSW COL* LED* LEDGND* ROW*; SPACEBARSW COL* LED* LEDGND* ROW*; TABSW 1* 2*; U101 30(RUN)* 35(ADC_VREF)* 36(3v3 (OUT))* 37(3v3_EN)* 44(+)* 45(-)* 46(GND)* 47(VCC)* 48(GND)* 49(GND)* 50(GND)*

## Notes on the sheets
sheet 3
- SK6812MINI-E
